# EAGLE schematic analog (EAGLE 6.5.0)
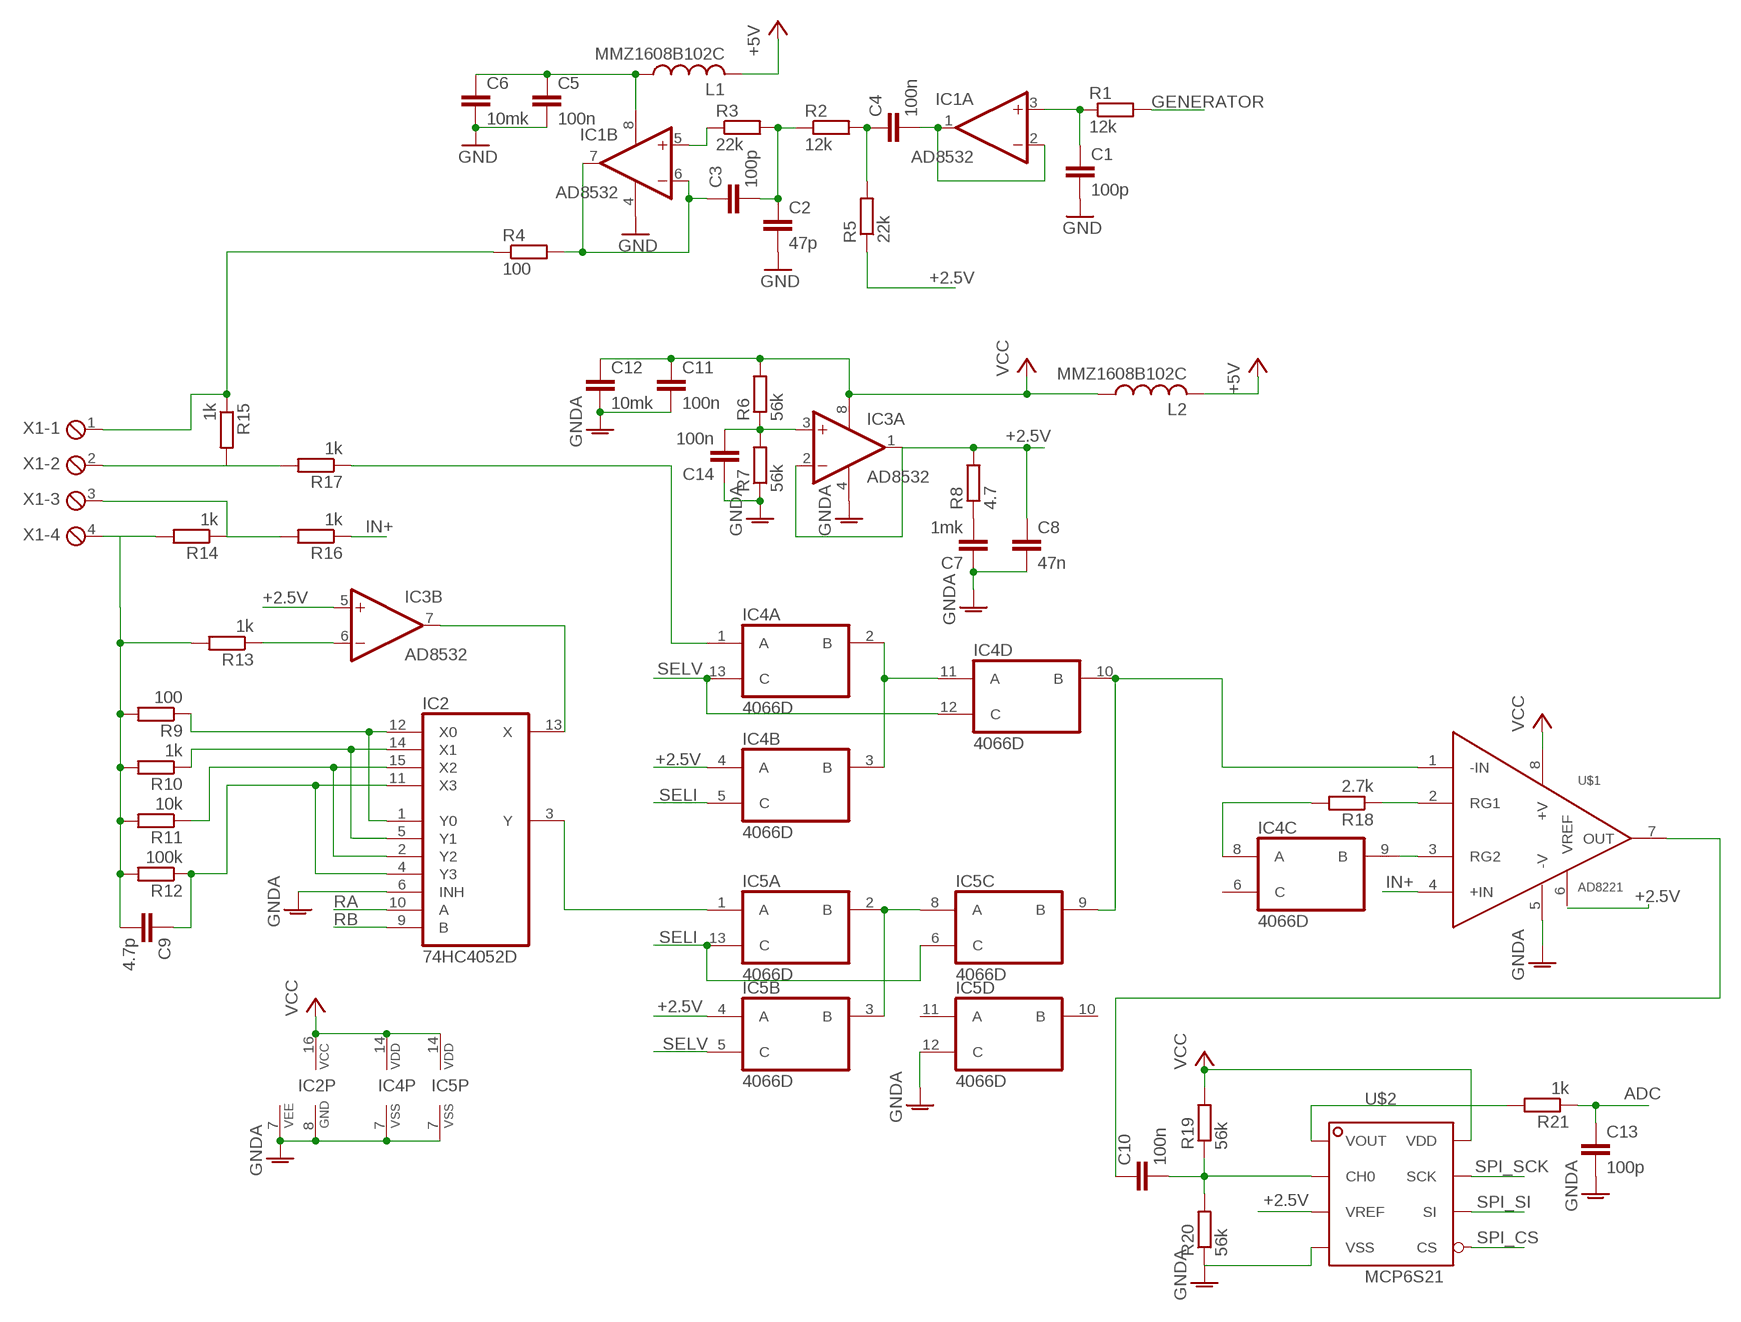
[diagram p0: schematic, sheet 1]

## Parts
C1  100p  C-EUC0805  [C0805]
C2  47p  C-EUC0805  [C0805]
C3  100p  C-EUC0805  [C0805]
C4  100n  C-EUC0603  [C0603]
C5  100n  C-EUC0603  [C0603]
C6  10mk  C-EUC0805  [C0805]
C7  1mk  C-EUC0603  [C0603]
C8  47n  C-EUC0805  [C0805]
C9  4.7p  C-EUC0805  [C0805]
C10  100n  C-EUC0603  [C0603]
C11  100n  C-EUC0603  [C0603]
C12  10mk  C-EUC0805  [C0805]
C13  100p  C-EUC0805  [C0805]
C14  100n  C-EUC0603  [C0603]
IC1  AD8532  LM358D  [SO08]
IC2  74HC4052D  4052D  [SO16]
IC3  AD8532  LM358D  [SO08]
IC4  4066D  [SO14]
IC5  4066D  [SO14]
L1  MMZ1608B102C  L-US  [R0603]
L2  MMZ1608B102C  L-US  [R0603]
R1  12k  R-EU_R0805  [R0805]
R2  12k  R-EU_R0805  [R0805]
R3  22k  R-EU_R0805  [R0805]
R4  100  R-EU_R0805  [R0805]
R5  22k  R-EU_R0805  [R0805]
R6  56k  R-EU_R0805  [R0805]
R7  56k  R-EU_R0805  [R0805]
R8  4.7  R-EU_R0805  [R0805]
R9  100  R-EU_R0805  [R0805]
R10  1k  R-EU_R0805  [R0805]
R11  10k  R-EU_R0805  [R0805]
R12  100k  R-EU_R0805  [R0805]
R13  1k  R-EU_R0805  [R0805]
R14  1k  R-EU_R0805  [R0805]
R15  1k  R-EU_R0805  [R0805]
R16  1k  R-EU_R0805  [R0805]
R17  1k  R-EU_R0805  [R0805]
R18  2.7k  R-EU_R0805  [R0805]
R19  56k  R-EU_R0805  [R0805]
R20  56k  R-EU_R0805  [R0805]
R21  1k  R-EU_R0805  [R0805]
U$1  AD8221  [SSOP08]
U$2  MCP6S21  [SO8]
X1  MPT4  [4POL254]

## Nets
+2.5V: C8.1 IC3.1(A:OUT) IC3.2(A:-IN) IC3.5(B:+IN) IC4.4(B:A) IC5.4(B:A) R5.1 R8.2 U$2.3(VREF)
+5V: L1.2 L2.2
ADC: C13.1 R21.1
GENERATOR: R1.2
GND: C1.2 C2.2 C5.2 C6.2 IC1.4(P:V-)
GNDA: C7.1 C8.2 C11.2 C12.2 C13.2 C14.1 IC2.6(INH) IC2.7(VEE) IC2.8(GND) IC3.4(P:V-) IC4.7(P:VSS) IC5.7(P:VSS) IC5.12(D:C) R7.1 R20.1 U$1.5(-V) U$2.4(VSS)
IN+: R16.1 U$1.4(+IN)
N$1: C4.2 IC1.1(A:OUT) IC1.2(A:-IN)
N$2: C1.1 IC1.3(A:+IN) R1.1
N$3: C2.1 C3.2 R2.1 R3.2
N$4: C4.1 R2.2 R5.2
N$5: C3.1 IC1.6(B:-IN) IC1.7(B:OUT) R4.2
N$6: IC1.5(B:+IN) R3.1
N$7: C5.1 C6.1 IC1.8(P:V+) L1.1
N$8: IC3.6(B:-IN) R13.1
N$9: C14.2 IC3.3(A:+IN) R6.1 R7.2
N$10: C7.2 R8.1
N$11: IC2.13(X) IC3.7(B:OUT)
N$12: IC2.1(Y0) IC2.12(X0) R9.1
N$13: IC2.5(Y1) IC2.14(X1) R10.1
N$14: IC2.2(Y2) IC2.15(X2) R11.1
N$15: C9.1 IC2.4(Y3) IC2.11(X3) R12.1
N$16: R14.1 R16.2 X1.3
N$17: R15.2 R17.2 X1.2
N$18: C9.2 R9.2 R10.2 R11.2 R12.2 R13.2 R14.2 X1.4
N$19: R4.1 R15.1 X1.1
N$20: IC4.1(A:A) R17.1
N$21: IC4.2(A:B) IC4.3(B:B) IC4.11(D:A)
N$22: IC5.2(A:B) IC5.3(B:B) IC5.8(C:A)
N$23: IC4.9(C:B) U$1.3(RG2)
N$24: R18.1 U$1.2(RG1)
N$25: IC4.10(D:B) IC5.9(C:B) U$1.1(-IN)
N$26: C10.1 U$1.7(OUT)
N$27: C10.2 R19.1 R20.2 U$2.2(CH0)
N$28: R21.2 U$2.1(VOUT)
N$29: IC2.3(Y) IC5.1(A:A)
N$30: IC4.8(C:A) R18.2
RA: IC2.10(A)
RB: IC2.9(B)
SELI: IC4.5(B:C) IC5.6(C:C) IC5.13(A:C)
SELV: IC4.12(D:C) IC4.13(A:C) IC5.5(B:C)
SPI_CS: U$2.5(CS)
SPI_SCK: U$2.7(SCK)
SPI_SI: U$2.6(SI)
VCC: C11.1 C12.1 IC2.16(VCC) IC3.8(P:V+) IC4.14(P:VDD) IC5.14(P:VDD) L2.1 R6.2 R19.2 U$1.8(+V) U$2.8(VDD)
Unconnected: IC4.6(C:C) IC5.10(D:B) IC5.11(D:A) U$1.6(VREF)

## Library data of the parts
C1-C14 = rcl:C-EU: CAPACITOR, European symbol
IC1 IC3 = linear:LM358: OP AMP also LM158; LM258; LM2904 Source: http://cache.national.com/ds/LM/LM158.pdf
IC2 = 40xx:4052: Dual 4-channel ANALOG MULTIPLEXER
IC4 IC5 = 40xx:4066: Quad bilateral ANALOG SWITCH
L1 L2 = rcl:L-US: INDUCTOR, American symbol
R1-R21 = rcl:R-EU_: RESISTOR, European symbol
U$1 = balmer:AD8221: Instrumental amplifier
U$2 = balmer:MCP6S21: Single-Ended, Rail-to-Rail I/O, Low Gain PGA
X1 = con-phoenix-254:MPT4: PHOENIX CONNECTOR; OC_FARNELL: unknown; OC_NEWARK: unknown